# EAGLE design dmx (EAGLE 6.4)
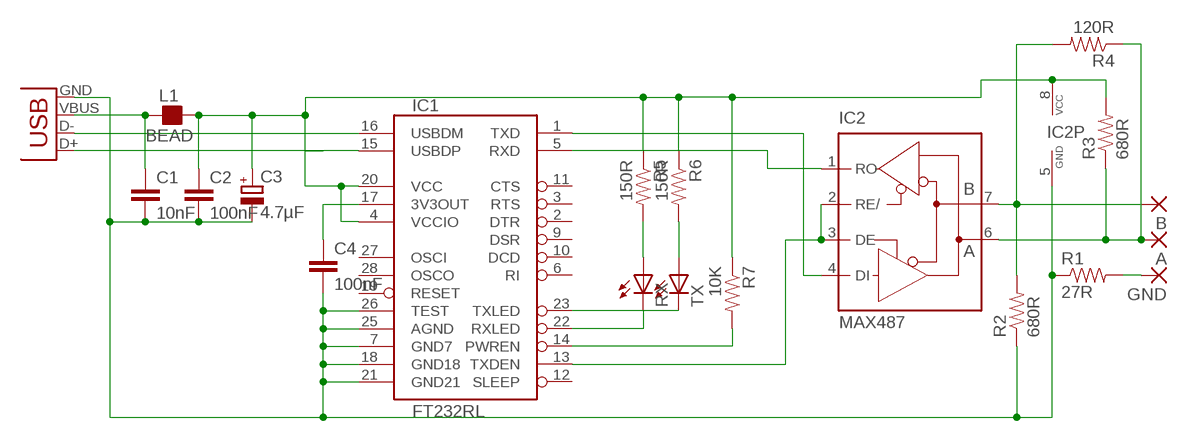
[diagram p0: schematic, sheet 1]

## Parts
A  SMD5  [SMD2,54-5,08]
B  SMD5  [SMD2,54-5,08]
C1  10nF  CAP0805  [0805]
C2  100nF  CAP0805  [0805]
C3  4.7µF  CPOL-EUSMCC  [SMC_C]
C4  100nF  CAP0805  [0805]
GND  SMD5  [SMD2,54-5,08]
IC1  FT232RL  FT232RLSSOP  [SSOP28DB]
IC2  MAX487  MAX481CSA  [SO08]
L1  BEAD  FB_0805  [L0805]
R1  27R  RESISTOR0805-RES  [0805]
R2  680R  RESISTOR0805-RES  [0805]
R3  680R  RESISTOR0805-RES  [0805]
R4  120R  RESISTOR0805-RES  [0805]
R5  150R  RESISTOR0805-RES  [0805]
R6  150R  RESISTOR0805-RES  [0805]
R7  10K  RESISTOR0805-RES  [0805]
RX  LEDCHIP-LED0805  [CHIP-LED0805]
TX  LEDCHIP-LED0805  [CHIP-LED0805]
X7  USB-SMD-NS  [USB-MINIB-NOSTOP]

## Nets
+USB_SIEVED: C2.1 C3.+ IC1.4(VCCIO) IC1.20(VCC) IC2.8(VCC) L1.2 R3.2 R5.1 R6.1 R7.1
GND_USB: C1.2 C2.2 C3.- C4.2 IC1.7(GND7) IC1.18(GND18) IC1.21(GND21) IC1.25(AGND) IC1.26(TEST) IC2.5(GND) R1.1 R2.1 X7.GND
N$1: IC1.13(TXDEN) IC2.2(RE/) IC2.3(DE)
N$2: GND.1(P) R1.2
N$3: IC1.5(RXD) IC2.1(RO)
N$4: IC1.1(TXD) IC2.4(DI)
N$5: B.1(P) IC2.7(B) R2.2 R4.2
N$6: A.1(P) IC2.6(A) R3.1 R4.1
N$7: IC1.16(USBDM) X7.D-
N$24: IC1.15(USBDP) X7.D+
N$25: R5.2 RX.A
N$26: R6.2 TX.A
N$27: IC1.22(RXLED) RX.C
N$28: IC1.23(TXLED) TX.C
N$29: C4.1 IC1.17(3V3OUT)
N$30: C1.1 L1.1 X7.VBUS
N$31: IC1.14(PWREN) R7.2
Unconnected: IC1.2(DTR) IC1.3(RTS) IC1.6(RI) IC1.9(DSR) IC1.10(DCD) IC1.11(CTS) IC1.12(SLEEP) IC1.19(RESET) IC1.27(OSCI) IC1.28(OSCO)

## Library data of the parts
A B GND = wirepad:SMD5: SMD PAD
C1 C2 C4 = SparkFun:CAP: Capacitor Standard 0603 ceramic capacitor, and 0.1" leaded capacitor.
C3 = resistor:CPOL-EU: POLARIZED CAPACITOR, European symbol
IC1 = SparkFun:FT232RL: USB UART FT232RL 4th Generation USB UART (USB <-> Serial) Controller. Spark Fun Electronics SKU : COM-00650
IC2 = maxim:MAX481CSA: RS485 TRANSEIVER; MF: MAXIM; MPN: MAX481CSA; OC_FARNELL: unknown; OC_NEWARK: 90C3817
L1 = rc-master-smd:FB_: FERRITE BEAD
R1-R7 = SparkFun:RESISTOR: Resistor Basic schematic elements and footprints for 0603, 1206, and PTH resistors.
RX TX = led:LED: LED OSRAM: - CHIPLED LG R971, LG N971, LY N971, LG Q971, LY Q971, LO R971, LY R971 LH N974, LH R974 LS Q976, LO Q976, LY Q976 LO Q996 - Hyper CHIPLED LW Q18S LB Q993, LB Q99A, LB R99A - SideLED LS A670, LO A670, LY A670, LG A670, LP A670 LB A673, LV A673, LT A673, LW A673 LH A674 LY A675 LS A676, LA A676, LO A676, LY A676, LW A676 LS A679, LY A679, LG A679 - Hyper Micro SIDELED® LS Y876, LA Y876, LO Y876, LY Y876 LT Y87S - SmartLED LW L88C, LW L88S LB L89C, LB L89S, LG L890 LS L89K, LO L89K, LY L89K LS L896, LA L896, LO L896, LY L896 - TOPLED LS T670, LO T670, LY T670, LG T670, LP T670 LSG T670, LSP T670, LSY T670, LOP T670, LYG T670 LG T671, LOG T671, LSG T671 LB T673, LV T673, LT T673, LW T673 LH T674 LS T676, LA T676, LO T676, LY T676, LB T676, LH T676, LSB T676, LW T676 LB T67C, LV T67C, LT T67C, LS T67K, LO T67K, LY T67K, LW E67C LS E67B, LA E67B, LO E67B, LY E67B, LB E67C, LV E67C, LT E67C LW T67C LS T679, LY T679, LG T679 LS T770, LO T770, LY T770, LG T770, LP T770 LB T773, LV T773, LT T773, LW T773 LH T774 LS E675, LA E675, LY E675, LS T675 LS T776, LA T776, LO T776, LY T776, LB T776 LHGB T686 LT T68C, LB T68C - Hyper Mini TOPLED® LB M676 - Mini TOPLED Santana® LG M470 LS M47K, LO M47K, LY M47K Source: http://www.osram.convergy.de LUXEON: - LUMILED® LXK2-PW12-R00, LXK2-PW12-S00, LXK2-PW14-U00, LXK2-PW14-V00 LXK2-PM12-R00, LXK2-PM12-S00, LXK2-PM14-U00 LXK2-PE12-Q00, LXK2-PE12-R00, LXK2-PE12-S00, LXK2-PE14-T00, LXK2-PE14-U00 LXK2-PB12-K00, LXK2-PB12-L00, LXK2-PB12-M00, LXK2-PB14-N00, LXK2-PB14-P00, LXK2-PB14-Q00 LXK2-PR12-L00, LXK2-PR12-M00, LXK2-PR14-Q00, LXK2-PR14-R00 LXK2-PD12-Q00, LXK2-PD12-R00, LXK2-PD12-S00 LXK2-PH12-R00, LXK2-PH12-S00 LXK2-PL12-P00, LXK2-PL12-Q00, LXK2-PL12-R00 Source: www.luxeon.com KINGBRIGHT: KA-3528ASYC Source: www.kingbright.com
X7 = SparkFun:USB: USB Connectors USB-B-PTH is fully proven SKU : PRT-00139 USB-miniB is fully proven SKU : PRT-00587 USB-A-PCB is untested. USB-A-H is throughly reviewed, but untested. Spark Fun Electronics SKU : PRT-00437 USB-B-SMT is throughly reviewed, but untested. Needs silkscreen touching up. USB-A-S has not been used/tested USB-MB-H has not been used/tested

## Board
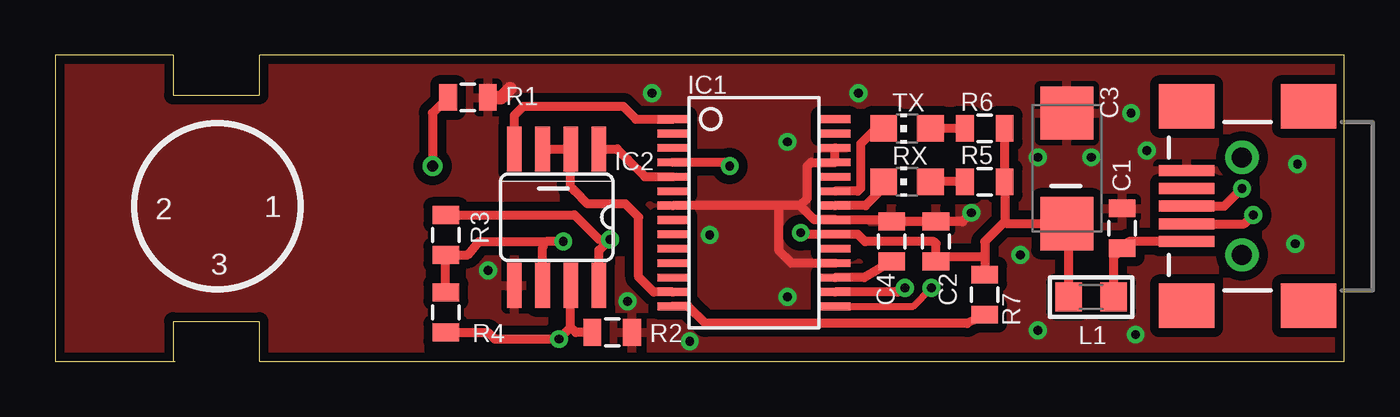
[diagram p1: board, top side]
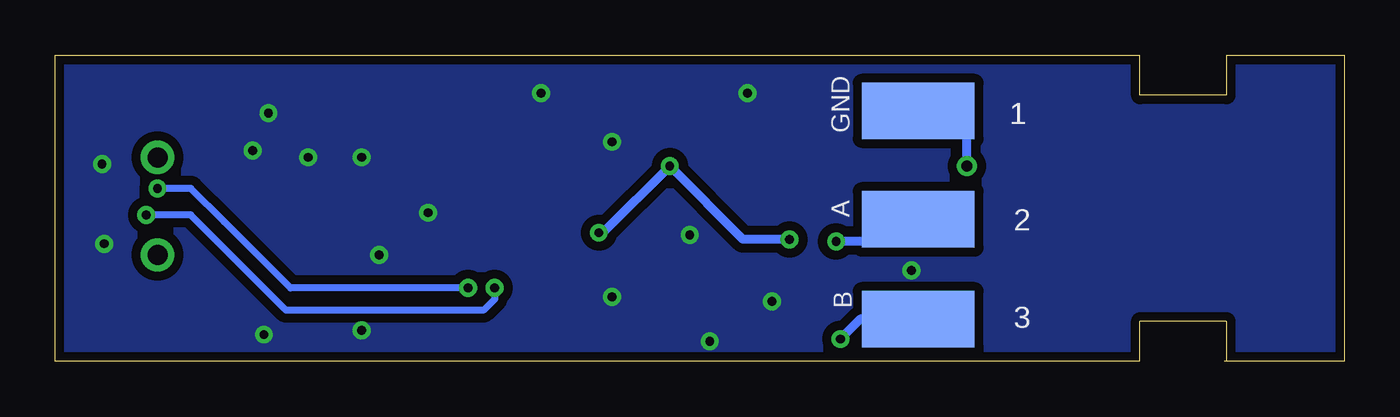
[diagram p2: board, bottom side, seen from below]

Size 58.1 x 13.8 mm. Coordinates in mm from the lower left corner, seen from the top.
Outline: 0,0 5.4,0 5.3,0 5.3,1.8 9.2,1.8 9.2,0 58.1,0 58.1,13.8 9.2,13.8 9.2,12 5.3,12 5.3,13.8 0,13.8 0,0
Copper layers (1*16): Top 0.035mm / dielectric 1.5mm / Bottom 0.035mm
Design rules "default": minimum track width 0.2mm, minimum drill 0.4mm, track to track 0.2mm, track to pad 0.2mm, pad to pad 0.2mm, via to via 0.2mm, smd to smd 0mil, copper to edge 0.4mm, drill to drill 8mil, minimum pad ring 0.3mm, minimum via ring 8mil, stop-mask expansion 4mil, vias tented up to drill 40mil, thermal gap 10mil

### Footprints (pad centres in the part's own frame; a part is rotated, then mirrored left to right if it is on the bottom)
SMD2,54-5,08 = smd 2.54 x 5.08: 1 0,0
0805 = smd 0.8 x 1.2: 1 -0.9,0; 2 0.9,0
SMC_C = smd 2.4 x 2.4: + -2.5,0; - 2.5,0
SSOP28DB = smd 0.348 x 1.397: 1 -4.225,-3.656; 2 -3.575,-3.656; 3 -2.925,-3.656; 4 -2.275,-3.656; 5 -1.625,-3.656; 6 -0.975,-3.656; 7 -0.325,-3.656; 8 0.325,-3.656; 9 0.975,-3.656; 10 1.625,-3.656; 11 2.275,-3.656; 12 2.925,-3.656; 13 3.575,-3.656; 14 4.225,-3.656; 15 4.225,3.656; 16 3.575,3.656; 17 2.925,3.656; 18 2.275,3.656; 19 1.625,3.656; 20 0.975,3.656; 21 0.325,3.656; 22 -0.325,3.656; 23 -0.975,3.656; 24 -1.625,3.656; 25 -2.275,3.656; 26 -2.925,3.656; 27 -3.575,3.656; 28 -4.225,3.656
SO08 = smd 0.66 x 2.032: 1 -1.905,-3.073; 2 -0.635,-3.073; 3 0.635,-3.073; 4 1.905,-3.073; 5 1.905,3.073; 6 0.635,3.073; 7 -0.635,3.073; 8 -1.905,3.073
L0805 = smd 1.2 x 1.3: 1 -1.016,0; 2 1.016,0
CHIP-LED0805 = smd 1.2 x 1.2: A 0,-1.05; C 0,1.05
USB-MINIB-NOSTOP = smd 2.5 x 0.5: D+ 2.5,0; D- 2.5,0.8; GND 2.5,-1.6; ID 2.5,-0.8; VBUS 2.5,1.6 | smd 2.5 x 2: G1 -3,-4.5; G2 -3,4.5; G3 2.5,4.5; G4 2.5,-4.5 | drill 0.9 pad 0.8: H1 0,2.2 | drill 0.9 pad 0.787: H2 0,-2.2

### Placement (x,y rotation side)
A  19.2,6.4 90 bottom
B  19.2,1.9 90 bottom
C1  48.1,6 90 top
C2  39.7,5.4 90 top
C3  45.6,8.7 90 top
C4  37.7,5.4 90 top
GND  19.2,11.3 90 bottom
IC1  31.5,6.7 270 top
IC2  22.6,6.5 180 top
L1  46.7,2.9 180 top
R1  18.6,11.9 180 top
R2  25.1,1.3 180 top
R3  17.6,5.7 90 top
R4  17.6,2.2 270 top
R5  41.9,8.1 180 top
R6  41.9,10.5 180 top
R7  41.9,3 270 top
RX  38.4,8.1 90 top
TX  38.4,10.5 90 top
X7  53.5,7 180 top

### Tracks (layer width: path | path; a pad name or v marks a point on that pad's centre or on a via)
+USB_SIEVED  (via drill 0.4)
  Top 0.406: v33.6,5.8 33.67,5.73 IC1.20 36.17,5.73 36.5,5.4 39.6,5.4 39.7,5.3 C2.1 39.9,4.7 41.9,4.7 | v30.4,8.8 30.22,8.98 IC1.4 | 42,4 R7.1 41.9,4.7 | R6.1 R5.1 42.8,6.3 | 41.9,4.7 41.9,5.4 42.8,6.3 | IC2.8 24.5,5.01 v25,5.5 24.5,5.5 23.4,6.6 R3.2 | L1.2 45.68,6.12 C3.+ 42.9,6.2 42.8,6.3
  Bottom 0.406: v33.6,5.8 33.4,5.8 v30.4,8.8 27.1,5.5 v25,5.5
GND_USB  (via drill 0.4)
  Top 0.406: IC1.21 35.13,6.4 34.3,6.4 | 33.58,7.03 32.6,7.03 | 32.6,7.03 IC1.7 | 33.58,7.03 34.22,6.38 IC1.21 | IC1.18 33.17,4.42 32.6,5 32.6,7.03 | IC1.21 37.62,6.38 C4.2 C2.2 40.9,6.3 v41.3,6.7 | IC1.26 IC1.25 34.08,8.98 33.9,8.8 33.9,7.35 33.58,7.03
  Top 0.61: R1.1 20.1,11.9 20.5,12.3
  other vias: 43.5,4.8 49.2,9.5 44.3,9.2 33,9.9 29.5,5.7 33,2.9 26.9,12.1 25.8,2.7 19.5,4.1 46.7,9.2 36.2,12.1 48.5,11.2 48.7,1.2 56,8.9 55.9,5.3 28.6,0.9 44.3,1.4
  pour Bottom (isolate 0.406): 0,0 58.1,0 58,13.8 0,13.8
  pour Top (isolate 0.406): 0,0 58.1,0 58,13.8 0,13.8
N$1
  Top 0.406: IC2.3 IC2.2 23.23,7.87 23.4,7.7 24,7.1 25.7,7.1 26.3,6.5 26.3,3.8 26.97,3.12 IC1.13
N$2  (via drill 0.5)
  Top 0.406: R1.2 17,11.2 v17,8.8
  Bottom 0.406: v17,8.8 17,10.1 17.7,10.8 18.7,10.8 GND.1
N$3
  Top 0.406: IC2.1 25.33,9.57 25.8,9.1 26.57,8.33 IC1.5
N$4
  Top 0.406: IC2.4 20.7,11.09 21.1,11.5 25.6,11.5 25.9,11.2 26.17,10.92 IC1.1
N$5  (via drill 0.4)
  Top 0.406: v22.7,1 19.8,1 19.5,1.3 R4.2 | v22.7,1 22.95,1.25 | 22.95,1.25 23.2,1.5 23.23,1.53 | 23.23,1.53 IC2.7 | R2.2 23.47,1.3 23.23,1.53 | v22.7,1 22.95,1.25
  Bottom 0.406: B.1 21.8,1.9 v22.7,1
N$6  (via drill 0.4)
  Top 0.406: IC2.6 21.96,5.14 22.02,5.28 | v22.9,5.4 22.13,5.4 22.02,5.28 | R4.1 R3.1 18.6,4.8 19.1,5.4 22.1,5.4 22.02,5.28
  Bottom 0.406: A.1 20.2,5.4 v22.9,5.4
N$7  (via drill 0.4)
  Top 0.406: IC1.16 37.97,3.12 v38.3,3.3 | X7.D- 53.6,6.2 v54,6.6
  Bottom 0.305: v38.3,3.3 38.3,2.8 38.8,2.3 40.2,2.3 47.7,2.3 50,4.6 52,6.6 v54,6.6
N$24  (via drill 0.4)
  Top 0.305: IC1.15 38.67,2.48 v39.5,3.3
  Top 0.406: X7.D+ 52.7,7 v53.5,7.8
  Bottom 0.305: v39.5,3.3 47.5,3.3 50.5,6.3 52,7.8 v53.5,7.8
N$25
  Top 0.406: R5.2 RX.A
N$26
  Top 0.406: R6.2 TX.A
N$27
  Top 0.406: IC1.22 36.52,7.03 37.35,7.85 RX.C
N$28
  Top 0.406: IC1.23 36.17,7.67 36.3,7.8 36.3,9.8 37,10.5 TX.C
N$29
  Top 0.406: IC1.17 36.47,3.78 C4.1
N$30
  Top 0.406: X7.VBUS 48.4,5.4 C1.1 47.72,4.72 L1.1
N$31
  Top 0.406: R7.2 41.1,1.7 29.3,1.7 28.52,2.48 IC1.14

### Text on the board
tPlace: 2 | 1 | 3
bPlace: 1 | 2 | 3